# EasyEDA Pro project LampPCB.epro

# Schematic Schematic1
Board Name: Board1; Create Date: 2026-04-18; Page Name: P1; Project Name: acrylic rgb lamp; Schematic Name: Schematic1; Update Date: 2026-04-27; Company: EasyEDA.com; Page Size: A4; Version: V1.0
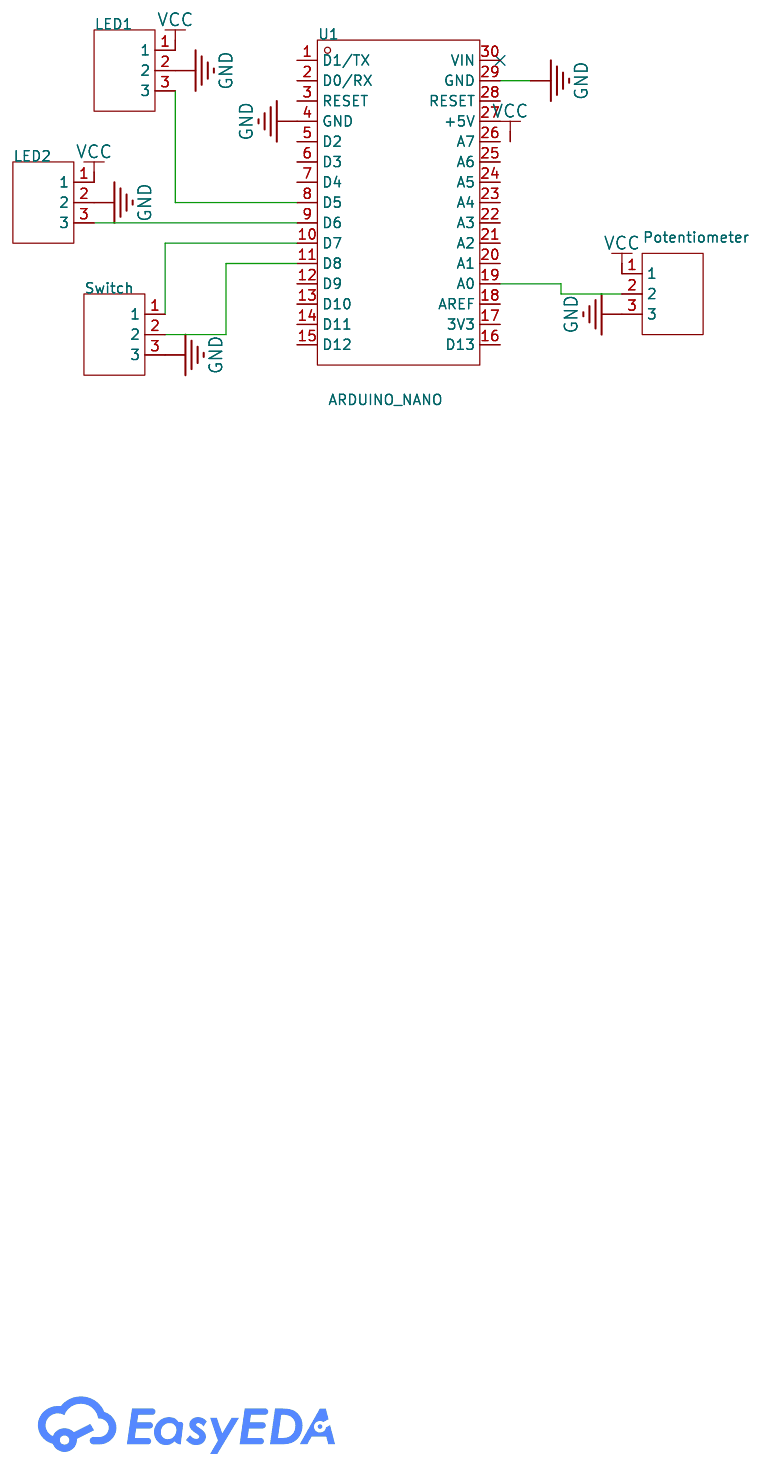
[diagram p0: schematic sheet]

## Parts
LED1  RE-H032TD-1130  [HDR-TH_3P-P2.54-V-M-1]
LED2  RE-H032TD-1130  [HDR-TH_3P-P2.54-V-M-1]
Potentiometer  RE-H032TD-1130  [HDR-TH_3P-P2.54-V-M-1]
Switch  RE-H032TD-1130  [HDR-TH_3P-P2.54-V-M-1]
U1  ARDUINO_NANO  [ARDUINO-nano-THT]

## Library data of the parts
LED1 LED2 Potentiometer Switch = RE-H032TD-1130: Pin Structure:1x3P Pitch:2.54mm Row Spacing:- Circluar Pins/Square Pins:Pin Header Mounting Type:Through Hole Number of Rows:1 Number of Pins:3P Current Rating:2A Voltage Rating (Max):250V Length of Mating Pin:6mm Insulation Height:2.54mm Length of End Co; LCSC Part Name: 1x3P 间距:2.54mm 方针 直插; Supplier Part: C265013; Manufacturer: JST; Supplier Footprint: 插件,P=2.54mm; JLCPCB Part Class: Extended Part; Datasheet: https://item.szlcsc.com/datasheet/RE-H032TD-1130/255434.html; Supplier: LCSC; Pin Structure: 1x3P; Pitch: 2.54mm; Circluar Pins/Square Pins: Pin Header; Mounting Type: Through Hole; Number of Rows: 1; Number of Pins: 3P; Current Rating: 2A; Voltage Rating (Max): 250V; Length of Mating Pin: 6mm; Insulation Height: 2.54mm; Length of End Connection Pin: 3mm; Contact Material: Brass; Contact Plating: Gold; Operating Temperature: -55℃~+105℃; Color: Black
U1 = ARDUINO_NANO_SMD_V3: Supplier Part: C9900017879; JLCPCB Part Class: Extended Part; Supplier: LCSC

## Nets
GND: LED1.2 LED2.2 Potentiometer.3 Switch.3 U1.4(GND) U1.29(GND)
VCC: LED1.1 LED2.1 Potentiometer.1
$1N1322: LED1.3 U1.8(D5)
$1N1945: LED2.3 U1.9(D6)
$1N2353: Switch.1 U1.10(D7)
$1N2358: Switch.2 U1.11(D8)
$1N2445: Potentiometer.2 U1.19(A0)

Not connected (* = marked no-connect by the designer): U1 1(D1/TX) 2(D0/RX) 3(RESET) 5(D2) 6(D3) 7(D4) 12(D9) 13(D10) 14(D11) 15(D12) 16(D13) 17(3V3) 18(AREF) 20(A1) 21(A2) 22(A3) 23(A4) 24(A5) 25(A6) 26(A7) 27(+5V) 28(RESET) 30(VIN)*

# Board PCB1
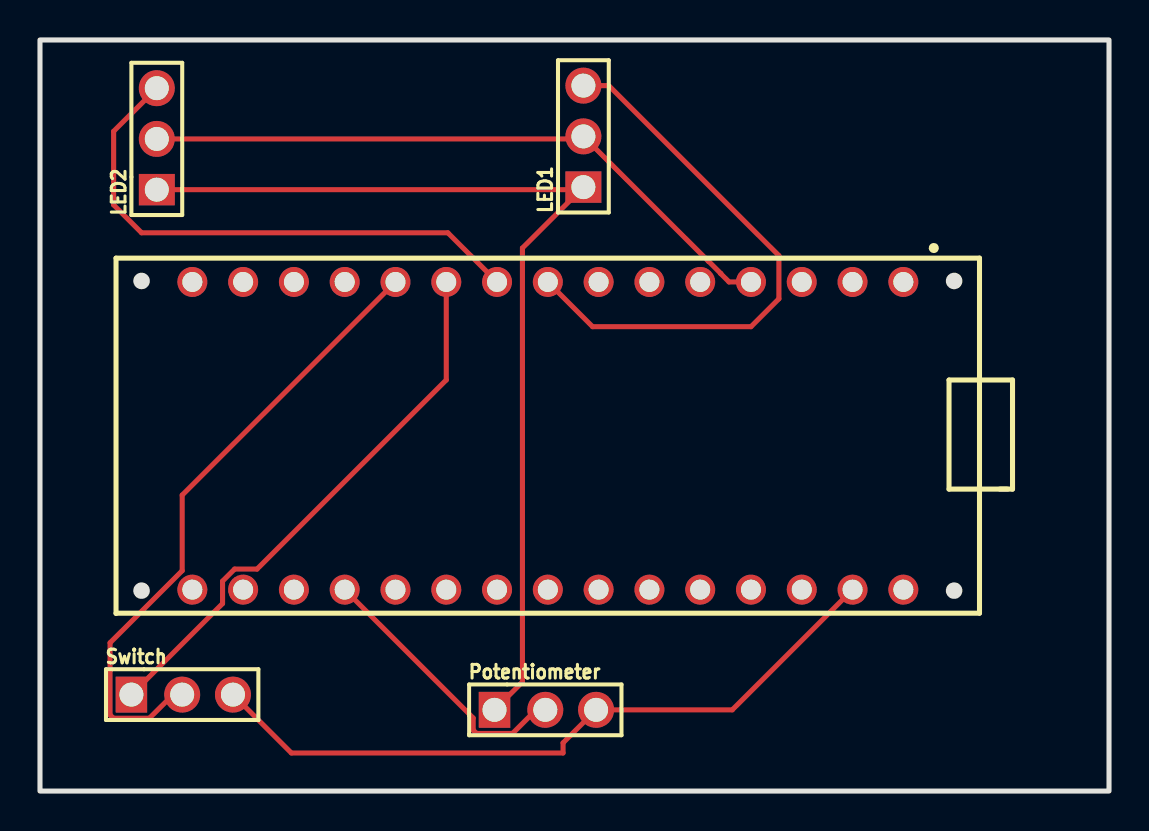
[diagram p1: board, top side]
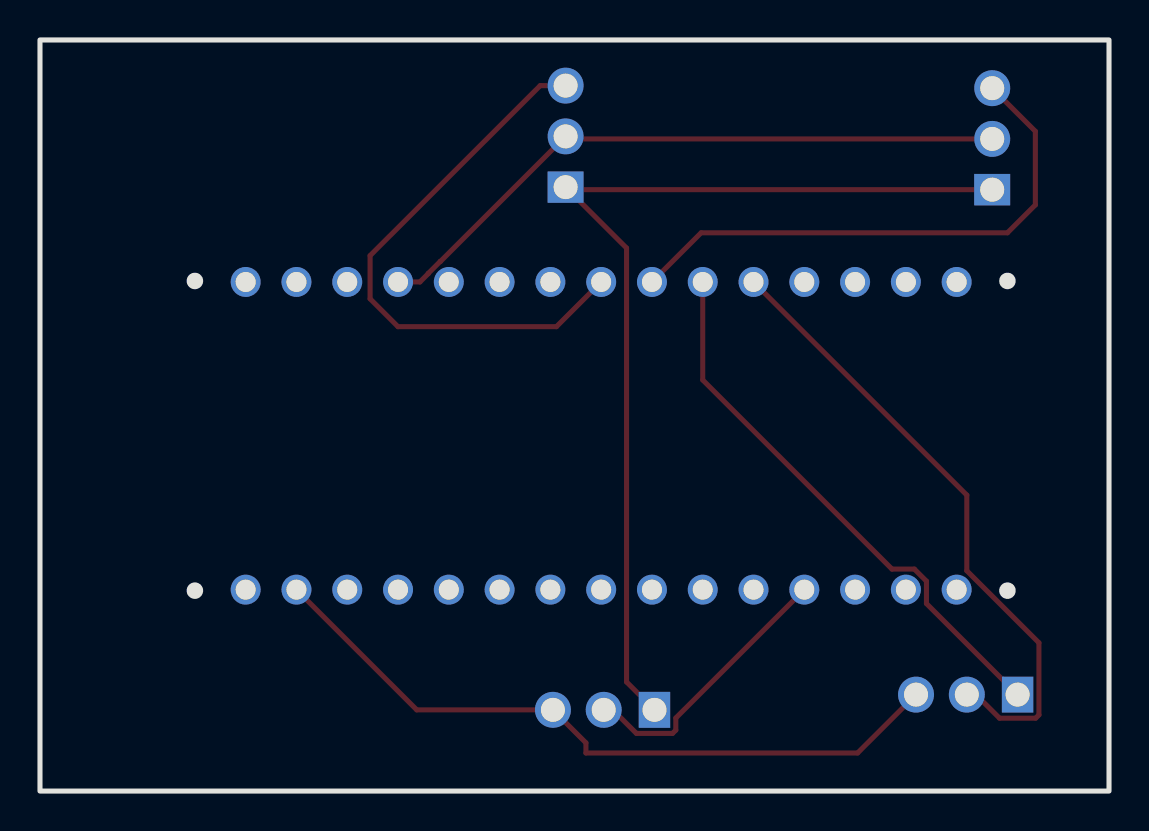
[diagram p2: board, bottom side, seen from below]

Outline 53.47 x 37.59 mm; copper layers: Top Layer, Bottom Layer. Coordinates in mm from the lower left corner of the outline.
Outline path: rectangle 0,37.59 53.47,0
Stack: Top Layer 0.035mm / Dielectric1 1.51mm FR4 er 4.5 / Bottom Layer 0.035mm

## Design rules (mm)
template: JLCPCB Capability(Two Layers Board)
spacing copperThickness1oz (default): track to track 0.102, other pairs 0.152 to 0.3
spacing copperThickness2oz: track to track 0.203, other pairs 0.152 to 0.3
track width copperThickness1oz (default): min 0.127, default 0.254, max 2.54
track width copperThickness2oz: min 0.203, default 0.254, max 2.54
differential pair differentialPair (default): width min 0.127, default 0.254, max 2.54; gap min 0.152, default 0.152
via viaSize (default): diameter min 0.5, default 0.61, max 10; hole min 0.3, default 0.305, max 6.3

## Placement (name value [footprint] x y rotation side)
LED1  RE-H032TD-1130  [HDR-TH_3P-P2.54-V-M-1]  27.18 32.77 90 top
LED2  RE-H032TD-1130  [HDR-TH_3P-P2.54-V-M-1]  5.84 32.64 90 top
Potentiometer  RE-H032TD-1130  [HDR-TH_3P-P2.54-V-M-1]  25.27 4.06 0 top
Switch  RE-H032TD-1130  [HDR-TH_3P-P2.54-V-M-1]  7.11 4.83 0 top
U1  ARDUINO_NANO  [ARDUINO-nano-THT]  25.4 17.78 180 top

## Footprints (pads in the part's own frame, mm; a bottom-side part is the same pattern mirrored in y, then rotated)
ARDUINO-nano-THT
  round 1.5 hole 1: 1(-17.78,-7.7) 2(-15.24,-7.7) 3(-12.7,-7.7) 4(-10.16,-7.7) 5(-7.62,-7.7) 6(-5.08,-7.7) 7(-2.54,-7.7) 8(0,-7.7) 9(2.54,-7.7) 10(5.08,-7.7) 11(7.62,-7.7) 12(10.16,-7.7) 13(12.7,-7.7) 14(15.24,-7.7) 15(17.78,-7.7) 16(17.78,7.7) 17(15.24,7.7) 18(12.7,7.7) 19(10.16,7.7) 20(7.62,7.7) 21(5.08,7.7) 22(2.54,7.7) 23(0,7.7) 24(-2.54,7.7) 25(-5.08,7.7) 26(-7.62,7.7) 27(-10.16,7.7) 28(-12.7,7.7) 29(-15.24,7.7) 30(-17.78,7.7)
HDR-TH_3P-P2.54-V-M-1
  rect 1.575x1.8 hole 1.2: 1(-2.54,0)
  round 1.8 hole 1.2: 2(0,0) 3(2.54,0)

## Nets
As in the schematic.

Pads without a net: U1 1 2 3 5 6 7 12 13 14 15 16 17 18 20 21 22 23 24 25 26 27 28 30

## Routing (per net, layer and track width the routed paths; a pad name or vN(x,y) marks a point on that pad's centre or on a via; arc(x,y) is an arc through that point)
GND: length 68.7
  Top Layer w0.254: U1.29 34.62,4.06 Potentiometer.3 26.16,2.41 26.16,1.91 12.57,1.91 Switch.3 ; U1.4 34.46,25.48 34.05,25.89 34.05,25.91 33.45,26.51 33.44,26.51 LED1.2 27.05,32.64 LED2.2
VCC: length 49.2
  Top Layer w0.254: Potentiometer.1 24.13,5.46 24.13,27.18 27.05,30.1 ; LED1.1 27.05,30.1 ; 27.05,30.1 LED2.1
$1N1322: length 28.5
  Top Layer w0.254: U1.8 27.64,23.24 35.56,23.24 36.96,24.64 36.96,26.8 28.45,35.31 LED1.3
$1N1945: length 27.5
  Top Layer w0.254: LED2.3 3.68,33.02 3.68,29.34 5.08,27.94 20.4,27.94 U1.9
$1N2353: length 27.8
  Top Layer w0.254: U1.10 20.32,20.57 10.86,11.11 9.73,11.11 9.13,10.51 9.13,9.38 Switch.1
$1N2358: length 31.7
  Top Layer w0.254: U1.11 7.11,14.81 7.11,11.03 3.51,7.42 3.51,3.81 3.67,3.65 5.48,3.65 6.65,4.83 Switch.2
$1N2445: length 13.9
  Top Layer w0.254: Potentiometer.2 24.81,4.06 23.64,2.88 21.83,2.88 21.67,3.05 21.67,3.65 U1.19
